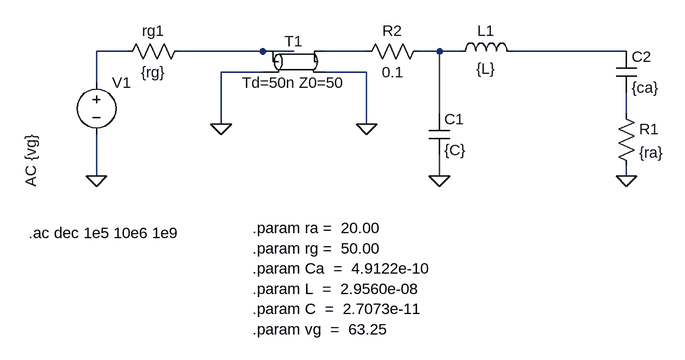
[diagram p0: schematic eje3_resuelto.asc]
eje3_resuelto.asc, the LTspice schematic file:
Version 4
SHEET 1 880 680
WIRE -240 -80 -288 -80
WIRE -32 -80 -160 -80
WIRE 16 -80 -32 -80
WIRE 128 -80 64 -80
WIRE 240 -80 208 -80
WIRE 272 -80 240 -80
WIRE 528 -80 352 -80
WIRE -32 -48 -96 -48
WIRE 128 -48 64 -48
WIRE -288 -32 -288 -80
WIRE 240 16 240 -80
WIRE 528 16 528 -16
WIRE -96 32 -96 -48
WIRE 128 32 128 -48
WIRE -288 112 -288 48
WIRE 240 112 240 80
WIRE 528 112 528 96
FLAG -288 112 0
FLAG 240 112 0
FLAG 128 32 0
FLAG -96 32 0
FLAG 528 112 0
SYMBOL voltage -288 -48 R0
WINDOW 3 -129 177 VLeft 2
WINDOW 123 -101 177 VLeft 2
WINDOW 39 0 0 Left 0
SYMATTR Value ""
SYMATTR Value2 AC {vg}
SYMATTR InstName V1
SYMBOL res -256 -64 R270
WINDOW 0 32 56 VTop 2
WINDOW 3 0 56 VBottom 2
SYMATTR InstName rg1
SYMATTR Value {rg}
SYMBOL cap 224 16 R0
SYMATTR InstName C1
SYMATTR Value {C}
SYMBOL ind 256 -64 R270
WINDOW 0 32 56 VTop 2
WINDOW 3 5 56 VBottom 2
SYMATTR InstName L1
SYMATTR Value {L}
SYMBOL tline 16 -64 R0
SYMATTR InstName T1
SYMBOL res 512 0 R0
SYMATTR InstName R1
SYMATTR Value {ra}
SYMBOL cap 512 -80 R0
SYMATTR InstName C2
SYMATTR Value {ca}
SYMBOL res 112 -64 R270
WINDOW 0 32 56 VTop 2
WINDOW 3 0 56 VBottom 2
SYMATTR InstName R2
SYMATTR Value 0.1
TEXT -392 200 Left 2 !.ac dec 1e5 10e6 1e9
TEXT -48 192 Left 2 !.param ra =  20.00 \n.param rg =  50.00 \n.param Ca  =  4.9122e-10 \n.param L  =  2.9560e-08 \n.param C  =  2.7073e-11 \n.param vg  =  63.25

The netlist it stands for:
* eje3_resuelto.asc
V1 N001 0 AC {vg}
rg1 N001 N002 {rg}
C1 N004 0 {C}
L1 N004 N005 {L}
T1 N002 0 N003 0 Td=50n Z0=50
R1 N006 0 {ra}
C2 N005 N006 {ca}
R2 N003 N004 0.1
.ac dec 1e5 10e6 1e9
.param ra =  20.00
.param rg =  50.00
.param Ca  =  4.9122e-10
.param L  =  2.9560e-08
.param C  =  2.7073e-11
.param vg  =  63.25
.backanno
.end